# Altium schematic sheet amp.SchDoc
size A; SheetNumber: 4; SheetTotal: 4
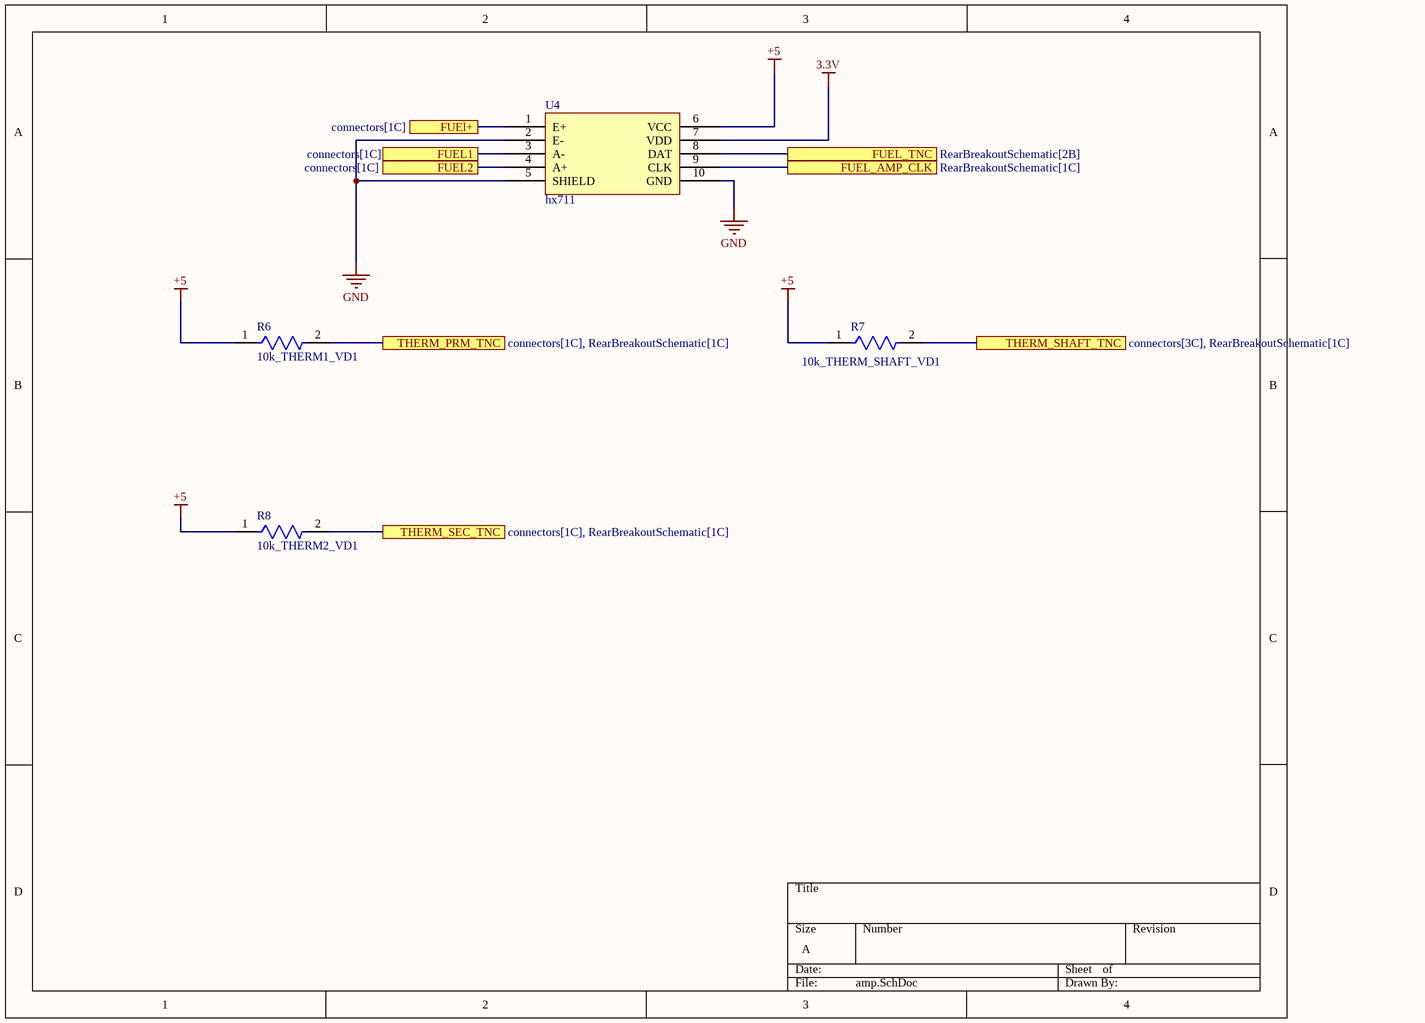
[diagram p0: amp.SchDoc]

## Parts
R6  10k_THERM1_VD1  [FP-CRCW0805-e3-IPC_C]
R7  10k_THERM_SHAFT_VD1  [FP-CRCW0805-e3-IPC_C]
R8  10k_THERM2_VD1  [FP-CRCW0805-e3-IPC_C]
U4  hx711  [PCBComponent_1]

## Ports
FUEL1 (see connectors[1C]), FUEL2 (see connectors[1C]), FUEl+ (see connectors[1C]), FUEL_AMP_CLK (see RearBreakoutSchematic[1C]), FUEL_TNC (see RearBreakoutSchematic[2B]), THERM_PRM_TNC (see connectors[1C], RearBreakoutSchematic[1C]), THERM_SEC_TNC (see connectors[1C], RearBreakoutSchematic[1C]), THERM_SHAFT_TNC (see connectors[3C], RearBreakoutSchematic[1C])

## Nets
3.3V: U4.7(VDD)
+5: R6.1 R7.1 R8.1 U4.6(VCC)
GND: U4.2(E-) U4.5(SHIELD) U4.10(GND)
FUEL1: U4.3(A-) ; port FUEL1
FUEL2: U4.4(A+) ; port FUEL2
FUEl+: U4.1(E+) ; port FUEl+
FUEL_AMP_CLK: U4.9(CLK) ; port FUEL_AMP_CLK
FUEL_TNC: U4.8(DAT) ; port FUEL_TNC
THERM_PRM_TNC: R6.2 ; port THERM_PRM_TNC
THERM_SEC_TNC: R8.2 ; port THERM_SEC_TNC
THERM_SHAFT_TNC: R7.2 ; port THERM_SHAFT_TNC

## Library data of the parts
R6-R8 = CMP-02407-009256-1: RES Thick Film, 4.02Ω, 1%, 0.125W, 200ppm/°C, 0805; Resistance: 4.02R; Power Rating: 125mW; Voltage Rating: 150V; Features: Automotive AEC-Q200; Weight: 0.000194oz; Height: 0.02inch; Case Code (Metric): 2012; Composition: Thick Film; Temperature Coefficient: 200ppm/°C; Case/Package: 0805; Min Operating Temperature: -55°C; Width: 0.049inch; Contact Plating: Tin; Packaging: Tape and Reel; Tolerance: 1%; Length: 0.079inch; Lead Free: Lead Free; Case Code (Imperial): 0805; Package Quantity: 5000; Radiation Hardening: No; Max Operating Temperature: 155°C; Number of Terminations: 2; Max Power Dissipation: 125mW; Voltage Rating (DC): 150V
U4 = Component_1